# Altium schematic sheet CellCircuit.SchDoc
size A
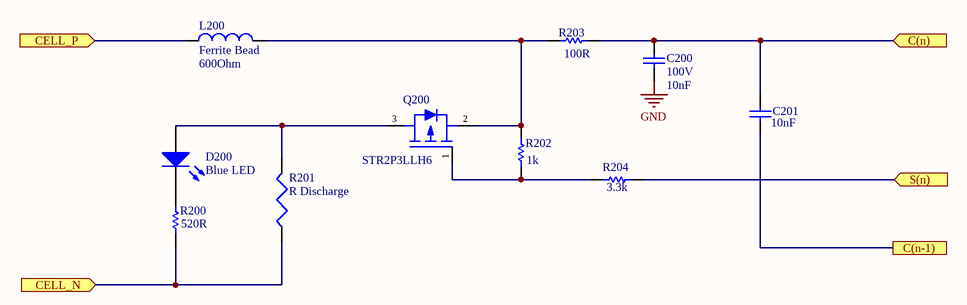
[diagram p0: CellCircuit.SchDoc]

## Parts
C200  100V  value 10nF  [RAD-0.3]
C201  value 10nF  [RAD-0.3]  (hidden comment: C0805)
D200  Blue LED  [LED-0]
L200  Ferrite Bead  value 600Ohm  [0402-A]
Q200  STR2P3LLH6  [SOT95P280X110-3N]
R200  value 520R  [AXIAL-0.3]  (hidden comment: R0805)
R201  R Discharge
R202  value 1k  [AXIAL-0.3]  (hidden comment: R0805)
R203  value 100R  [AXIAL-0.3]  (hidden comment: R0805)
R204  value 3.3k  [AXIAL-0.3]  (hidden comment: R0805)

## Ports
C(n) (in), C(n-1), CELL_N (in), CELL_P (in), S(n) (in)

## Nets
GND: C200.2
C(n): C200.1 C201.1 R203.1 ; port C(n)
C(n-1): C201.2 ; port C(n-1)
CELL_N: R200.1 R201.1 ; port CELL_N
CELL_P: L200.1 ; port CELL_P
S(n): R204.1 ; port S(n)
NetD200_1: D200.1(A) Q200.3 R201.2
NetD200_2: D200.2(K) R200.2
NetL200_2: L200.2 Q200.2 R202.2 R203.2
NetQ200_1: Q200.1 R202.1 R204.2

## Library data of the parts
C200 C201 = Cap: Capacitor; Published: 8-Jun-2000; LatestRevisionDate: 17-Jul-2002; LatestRevisionNote: Re-released for DXP Platform.; PackageReference: RAD-0.3; Publisher: Altium Limited; PackageDescription: Radial Cap, Thru-Hole; 2 Leads; 0.3 in Pin Spacing
D200 = LED0: Typical INFRARED GaAs LED; Published: 8-Jun-2000; LatestRevisionDate: 08-Jul-2005; LatestRevisionNote: Mech Layer 1 removed.; PackageReference: LED-0; Publisher: Altium Limited; PackageDescription: LED; 2 Leads
L200 = Inductor: Inductor Coil - Ferrite Bead; Code_IEC: 1005; Published: 8-Jun-2000; LatestRevisionDate: 29-May-2009; LatestRevisionNote: IPC-7351 Footprint Added.; PackageReference: 0402-A; Publisher: Altium Limited; PackageDescription: Chip Inductor; Code_JEITA: 0402
Q200 = STR2P3LLH6: P-channel -30 V, 48 mΩ typICAL, -2 A STripFET™ H6 Power MOSFET in a SOT-23 package.
R200 R202-R204 = Res1: Resistor; Published: 8-Jun-2000; LatestRevisionDate: 17-Jul-2002; LatestRevisionNote: Re-released for DXP Platform.; PackageReference: AXIAL-0.3; Publisher: Altium Limited; PackageDescription: Axial Device, Thru-Hole; 2 Leads; 0.3 in Pin Spacing
R201 = R Discharge: Discharge Resistance